# Altium schematic sheet 452006257#BDU控制板2-单片机.SchDoc
size A3; SheetNumber: 7; SheetTotal: 11
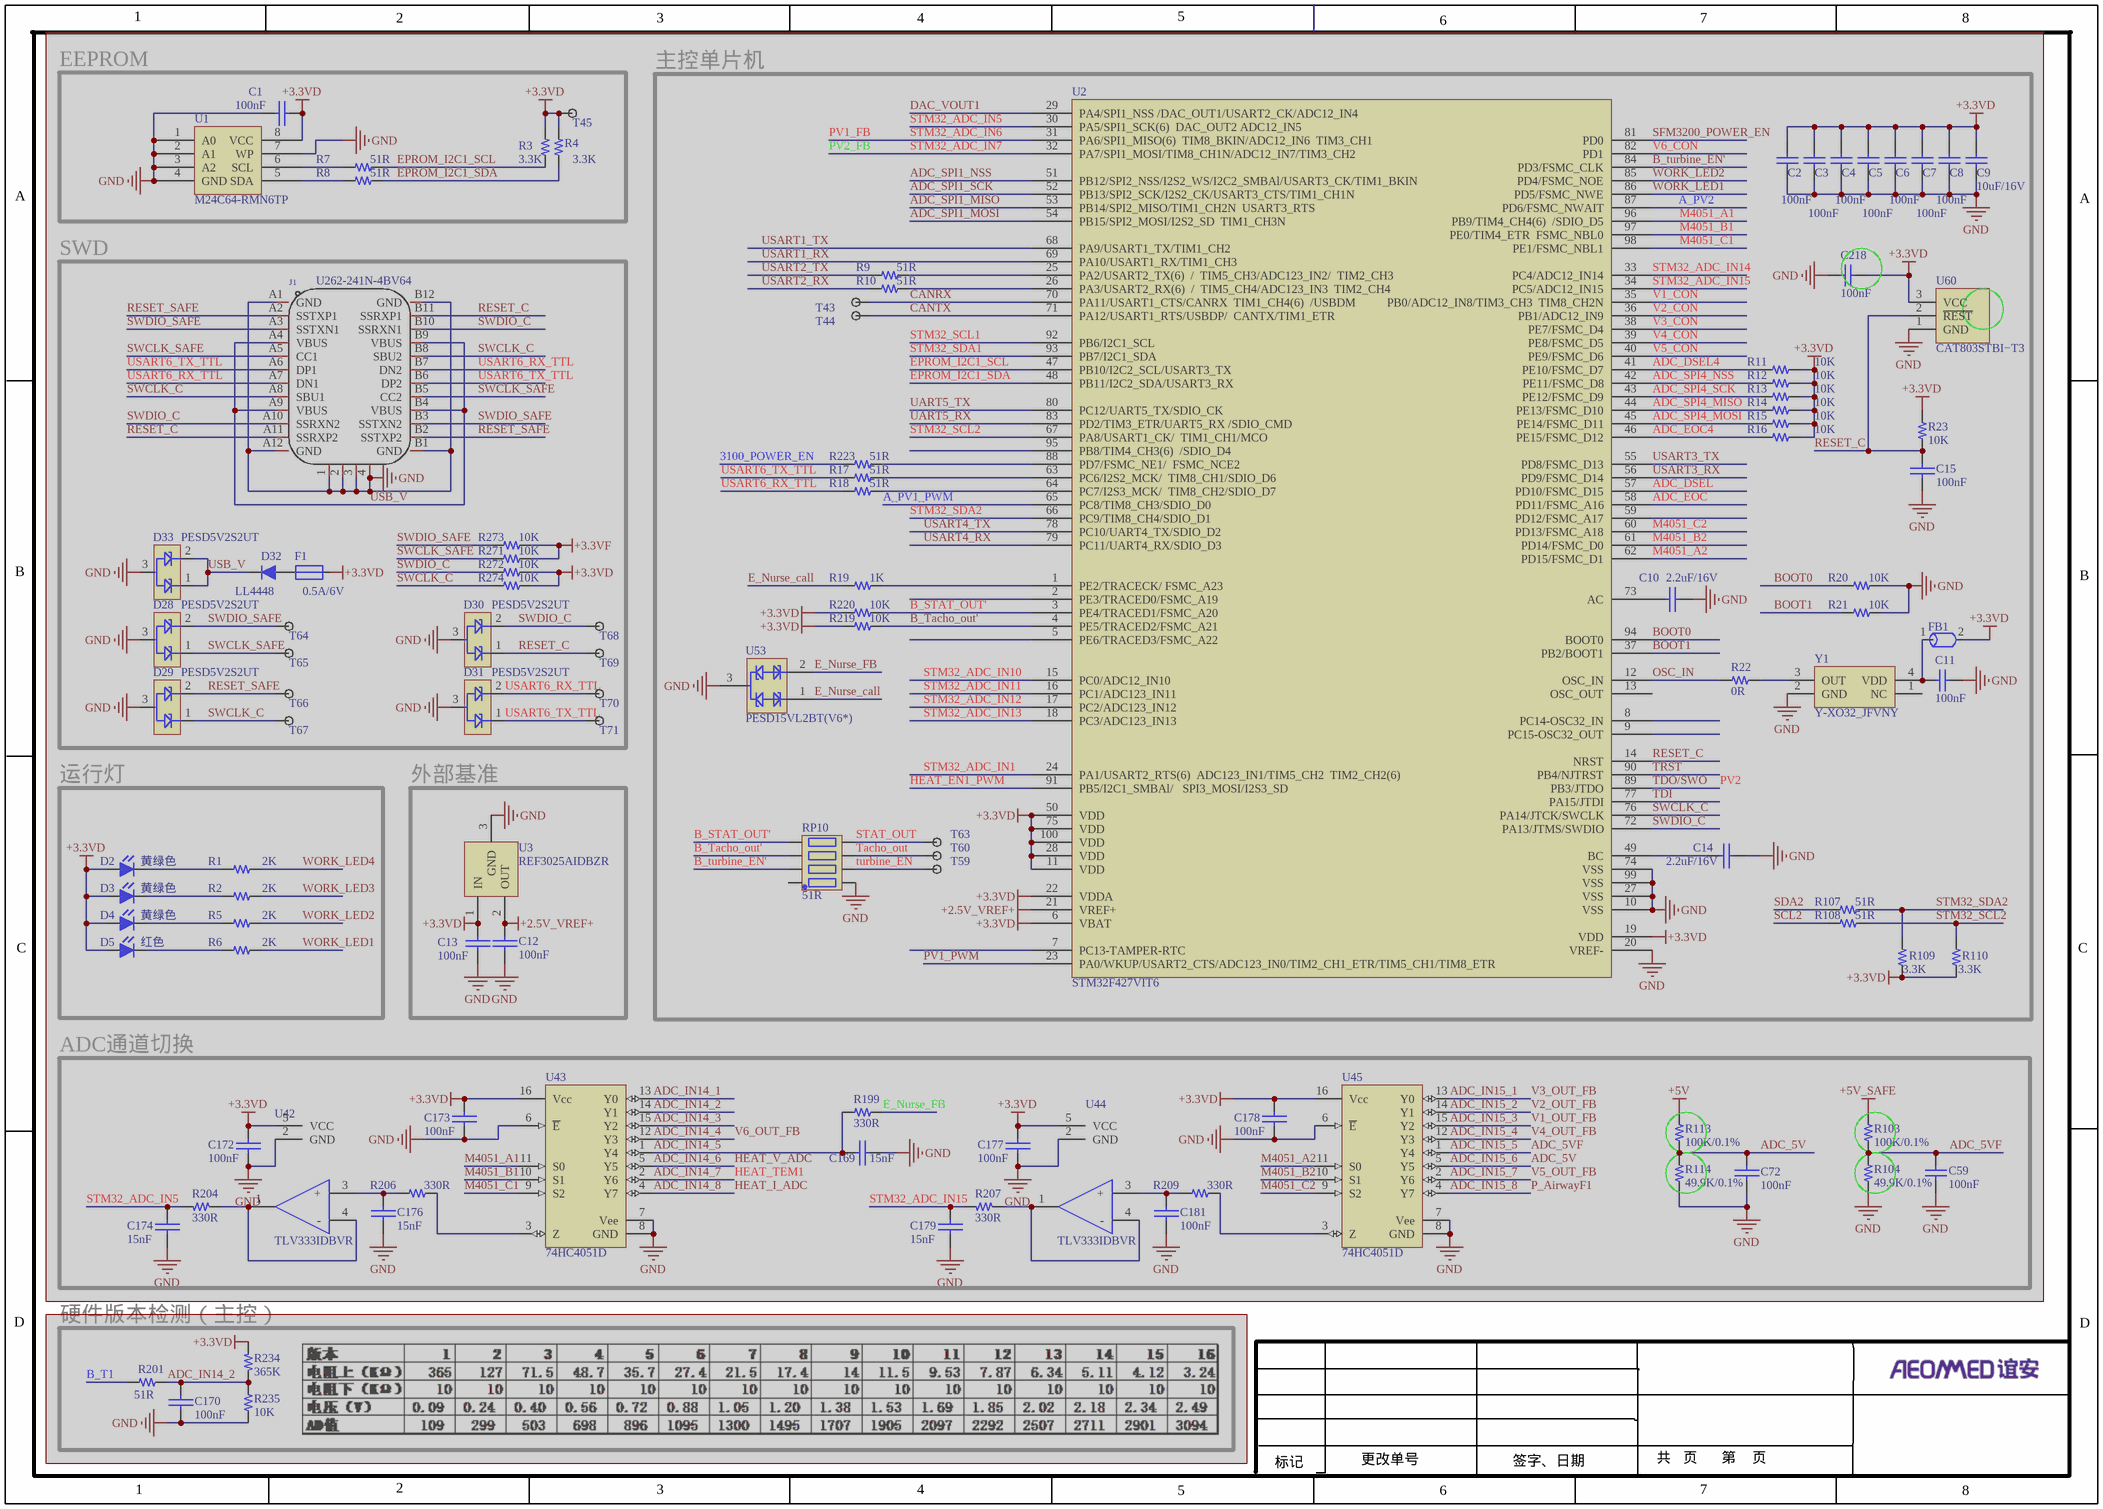
[diagram p0: 452006257#BDU控制板2-单片机.SchDoc]

## Parts
C1  100nF  [C-0603]  (masked out: inside a compile mask, not in the netlist)
C2  100nF  [C-0603]  (masked out: inside a compile mask, not in the netlist)
C3  100nF  [C-0603]  (masked out: inside a compile mask, not in the netlist)
C4  100nF  [C-0603]  (masked out: inside a compile mask, not in the netlist)
C5  100nF  [C-0603]  (masked out: inside a compile mask, not in the netlist)
C6  100nF  [C-0603]  (masked out: inside a compile mask, not in the netlist)
C7  100nF  [C-0603]  (masked out: inside a compile mask, not in the netlist)
C8  100nF  [C-0603]  (masked out: inside a compile mask, not in the netlist)
C9  10uF/16V  [C-0805]  (masked out: inside a compile mask, not in the netlist)
C10  2.2uF/16V  [C-0805]  (masked out: inside a compile mask, not in the netlist)
C11  100nF  [C-0603]  (masked out: inside a compile mask, not in the netlist)
C12  100nF  [C-0603]  (masked out: inside a compile mask, not in the netlist)
C13  100nF  [C-0603]  (masked out: inside a compile mask, not in the netlist)
C14  2.2uF/16V  [C-0805]  (masked out: inside a compile mask, not in the netlist)
C15  100nF  [C-0603]  (masked out: inside a compile mask, not in the netlist)
C59  100nF  [C-0603]  (masked out: inside a compile mask, not in the netlist)
C72  100nF  [C-0603]  (masked out: inside a compile mask, not in the netlist)
C169  15nF  [C-0603]  (masked out: inside a compile mask, not in the netlist)
C170  100nF  [C-0603]  (masked out: inside a compile mask, not in the netlist)
C172  100nF  [C-0603]  (masked out: inside a compile mask, not in the netlist)
C173  100nF  [C-0603]  (masked out: inside a compile mask, not in the netlist)
C174  15nF  [C-0603]  (masked out: inside a compile mask, not in the netlist)
C176  15nF  [C-0603]  (masked out: inside a compile mask, not in the netlist)
C177  100nF  [C-0603]  (masked out: inside a compile mask, not in the netlist)
C178  100nF  [C-0603]  (masked out: inside a compile mask, not in the netlist)
C179  15nF  [C-0603]  (masked out: inside a compile mask, not in the netlist)
C181  100nF  [C-0603]  (masked out: inside a compile mask, not in the netlist)
C218  100nF  [C-0603]  (masked out: inside a compile mask, not in the netlist)
D2  黄绿色  [LED-0805]  (masked out: inside a compile mask, not in the netlist)
D3  黄绿色  [LED-0805]  (masked out: inside a compile mask, not in the netlist)
D4  黄绿色  [LED-0805]  (masked out: inside a compile mask, not in the netlist)
D5  红色  [LED-0805]  (masked out: inside a compile mask, not in the netlist)
D28  PESD5V2S2UT  [sot23-3]  (masked out: inside a compile mask, not in the netlist)
D29  PESD5V2S2UT  [sot23-3]  (masked out: inside a compile mask, not in the netlist)
D30  PESD5V2S2UT  [sot23-3]  (masked out: inside a compile mask, not in the netlist)
D31  PESD5V2S2UT  [sot23-3]  (masked out: inside a compile mask, not in the netlist)
D32  LL4448  [DO-SOD-123]  (masked out: inside a compile mask, not in the netlist)
D33  PESD5V2S2UT  [sot23-3]  (masked out: inside a compile mask, not in the netlist)
F1  0.5A/6V  [R-1206]  (masked out: inside a compile mask, not in the netlist)
FB1  400R100MHz,0.3A,0805  [R-0805]  (value not drawn)  (masked out: inside a compile mask, not in the netlist)
J1  U262-241N-4BV64  [USB-C-SMD_TYC-324G]  (masked out: inside a compile mask, not in the netlist)
R1  2K  [R-0603]  (masked out: inside a compile mask, not in the netlist)
R2  2K  [R-0603]  (masked out: inside a compile mask, not in the netlist)
R3  3.3K  [R-0603]  (masked out: inside a compile mask, not in the netlist)
R4  3.3K  [R-0603]  (masked out: inside a compile mask, not in the netlist)
R5  2K  [R-0603]  (masked out: inside a compile mask, not in the netlist)
R6  2K  [R-0603]  (masked out: inside a compile mask, not in the netlist)
R7  51R  [R-0603]  (masked out: inside a compile mask, not in the netlist)
R8  51R  [R-0603]  (masked out: inside a compile mask, not in the netlist)
R9  51R  [R-0603]  (masked out: inside a compile mask, not in the netlist)
R10  51R  [R-0603]  (masked out: inside a compile mask, not in the netlist)
R11  10K  [R-0603]  (masked out: inside a compile mask, not in the netlist)
R12  10K  [R-0603]  (masked out: inside a compile mask, not in the netlist)
R13  10K  [R-0603]  (masked out: inside a compile mask, not in the netlist)
R14  10K  [R-0603]  (masked out: inside a compile mask, not in the netlist)
R15  10K  [R-0603]  (masked out: inside a compile mask, not in the netlist)
R16  10K  [R-0603]  (masked out: inside a compile mask, not in the netlist)
R17  51R  [R-0603]  (masked out: inside a compile mask, not in the netlist)
R18  51R  [R-0603]  (masked out: inside a compile mask, not in the netlist)
R19  1K  [R-0603]  (masked out: inside a compile mask, not in the netlist)
R20  10K  [R-0603]  (masked out: inside a compile mask, not in the netlist)
R21  10K  [R-0603]  (masked out: inside a compile mask, not in the netlist)
R22  0R  [R-0603]  (masked out: inside a compile mask, not in the netlist)
R23  10K  [R-0603]  (masked out: inside a compile mask, not in the netlist)
R103  100K/0.1%  [R-0603]  (masked out: inside a compile mask, not in the netlist)
R104  49.9K/0.1%  [R-0603]  (masked out: inside a compile mask, not in the netlist)
R107  51R  [R-0603]  (masked out: inside a compile mask, not in the netlist)
R108  51R  [R-0603]  (masked out: inside a compile mask, not in the netlist)
R109  3.3K  [R-0603]  (masked out: inside a compile mask, not in the netlist)
R110  3.3K  [R-0603]  (masked out: inside a compile mask, not in the netlist)
R113  100K/0.1%  [R-0603]  (masked out: inside a compile mask, not in the netlist)
R114  49.9K/0.1%  [R-0603]  (masked out: inside a compile mask, not in the netlist)
R199  330R  [R-0603]  (masked out: inside a compile mask, not in the netlist)
R201  51R  [R-0603]  (masked out: inside a compile mask, not in the netlist)
R204  330R  [R-0603]  (masked out: inside a compile mask, not in the netlist)
R206  330R  [R-0603]  (masked out: inside a compile mask, not in the netlist)
R207  330R  [R-0603]  (masked out: inside a compile mask, not in the netlist)
R209  330R  [R-0603]  (masked out: inside a compile mask, not in the netlist)
R219  10K  [R-0603]  (masked out: inside a compile mask, not in the netlist)
R220  10K  [R-0603]  (masked out: inside a compile mask, not in the netlist)
R223  51R  [R-0603]  (masked out: inside a compile mask, not in the netlist)
R234  365K  [R-0603]  (masked out: inside a compile mask, not in the netlist)
R235  10K  [R-0603]  (masked out: inside a compile mask, not in the netlist)
R271  10K  [R-0603]  (masked out: inside a compile mask, not in the netlist)
R272  10K  [R-0603]  (masked out: inside a compile mask, not in the netlist)
R273  10K  [R-0603]  (masked out: inside a compile mask, not in the netlist)
R274  10K  [R-0603]  (masked out: inside a compile mask, not in the netlist)
RP10  51R  [RP-0603]  (masked out: inside a compile mask, not in the netlist)
T43  直插测试点  [DIPTP]  (value not drawn)  (masked out: inside a compile mask, not in the netlist)
T44  直插测试点  [DIPTP]  (value not drawn)  (masked out: inside a compile mask, not in the netlist)
T45  直插测试点  [DIPTP]  (value not drawn)  (masked out: inside a compile mask, not in the netlist)
T59  直插测试点  [DIPTP]  (value not drawn)  (masked out: inside a compile mask, not in the netlist)
T60  直插测试点  [DIPTP]  (value not drawn)  (masked out: inside a compile mask, not in the netlist)
T63  直插测试点  [DIPTP]  (value not drawn)  (masked out: inside a compile mask, not in the netlist)
T64  直插测试点  [DIPTP]  (value not drawn)  (masked out: inside a compile mask, not in the netlist)
T65  直插测试点  [DIPTP]  (value not drawn)  (masked out: inside a compile mask, not in the netlist)
T66  直插测试点  [DIPTP]  (value not drawn)  (masked out: inside a compile mask, not in the netlist)
T67  直插测试点  [DIPTP]  (value not drawn)  (masked out: inside a compile mask, not in the netlist)
T68  直插测试点  [DIPTP]  (value not drawn)  (masked out: inside a compile mask, not in the netlist)
T69  直插测试点  [DIPTP]  (value not drawn)  (masked out: inside a compile mask, not in the netlist)
T70  直插测试点  [DIPTP]  (value not drawn)  (masked out: inside a compile mask, not in the netlist)
T71  直插测试点  [DIPTP]  (value not drawn)  (masked out: inside a compile mask, not in the netlist)
U1  M24C64-RMN6TP  [SOIC8]  (masked out: inside a compile mask, not in the netlist)
U2  STM32F427VIT6  [LQFP-100]  (masked out: inside a compile mask, not in the netlist)
U3  REF3025AIDBZR  [SOT23-3]  (masked out: inside a compile mask, not in the netlist)
U42  TLV333IDBVR  [SOT23-5]  (masked out: inside a compile mask, not in the netlist)
U43  74HC4051D  [SOIC-16(9.95*3.90)]  (masked out: inside a compile mask, not in the netlist)
U44  TLV333IDBVR  [SOT23-5]  (masked out: inside a compile mask, not in the netlist)
U45  74HC4051D  [SOIC-16(9.95*3.90)]  (masked out: inside a compile mask, not in the netlist)
U53  PESD15VL2BT(V6*)  [SOT23-3]  (masked out: inside a compile mask, not in the netlist)
U60  CAT803STBI−T3  [SOT23-3]  (masked out: inside a compile mask, not in the netlist)
Y1  Y-XO32_JFVNY  [Y-XO32_JFVNY]  (masked out: inside a compile mask, not in the netlist)

## Blocks framed on the sheet
EEPROM: C1 R3 R4 R7 R8 T45 U1
主控单片机: C2-C11 C14 C15 C218 FB1 R9-R23 R107-R110 R219 R220 R223 RP10 T43 T44 T59 T60 T63 U2 U53 U60 Y1
SWD: D28-D33 F1 J1 R271-R274 T64-T71
运行灯: D2-D5 R1 R2 R5 R6
外部基准: C12 C13 U3
ADC通道切换: C59 C72 C169 C172-C174 C176-C179 C181 R103 R104 R113 R114 R199 R204 R206 R207 R209 U42-U45
硬件版本检测（主控）: C170 R201 R234 R235

## Notes on the sheet
- 1
- 2
- 3
- 4
- 5
- 6
- 7
- 8
- A
- B
- C
- D
- 更改单号
- 共   页      第    页
- 标记
- 签字、日期

## Library data of the parts
C1 C10 C12-C15 C72 C169 C170 C172-C174 C176-C179 C181 = CAP: Capacitor
C2-C9 = CAP: Capacitor; Fitted: True
C11 C59 = C-0603: 物料编号: *; 物料名称: *; 厂家: *; 详细描述: *
C218 = C-0402: 物料编号: *; 物料名称: *; 厂家: *; 详细描述: *
D2-D5 = LED-0805
D28-D31 D33 = PESDxS2UT
D32 = Diode-SOD-123: 厂家: *; 物料名称: *; 物料编号: *; 详细描述: *
F1 = FSMD-1206: 品牌：Littelfuse，型号：1206L050YR，0.5A/6V，-40℃~85℃
FB1 = FB_1K/500mA_0805: Rdc0.3Ω,伍尔特,742792032; 名称: 贴片磁珠1K/500mA，0805; 版本: V1.00; 物料编号: 210001925; 详细描述: Rdc0.3,R材料,TDK MMZ2012R102A; 制造商: TDK
J1 = U262-241N-4BV64: 连接器类型:Type-C;标准:USB 3.1;公母:母座;触点数量:24;端口数量:1;安装方式:卧贴;额定电流 - 电源:5A;触头材质:铜合金;触头镀层:金;工作温度范围:-40℃~+85℃;焊接温度(最大值):260℃;; Manufacturer: XKB Connectivity(中国星坤); Add into BOM: yes; Connector Type: Type-C; Gender: 母座; Number of Contacts: 24; Number of Ports: 1; Current Rating - Power (Max): 5A; Welding Temperature (Max): 260℃; Name: U262-241N-4BV64; Symbol: U262-241N-4BV64; Device: U262-241N-4BV64; LCSC Part Name: Type-C 母座 卧贴; Supplier Part: C388660; Manufacturer Part: U262-241N-4BV64; Supplier Footprint: SMD; JLCPCB Part Class: Extended Part; Supplier: LCSC; Convert to PCB: yes; Standard: USB 3.1; Mounting Style: 卧贴; Contact Material: 铜合金; Contact Plating: 金; Operating Temperature Range: -40℃~+85℃
R1-R6 R11-R16 R22 R23 R103 R104 R113 R114 R199 R201 R204 R206 R207 R209 = R-0603
R7 R8 = 51Ω_1: 国巨RC0805FR-0751R; 物料编号: 210002130; 详细描述: 0805,1/8W,国巨RC0805FR-0751R; 制造商: 国巨; 版本: V1.00; 名称: 贴片电阻51±1%
R9 R10 R17-R21 R107-R110 R219 R220 R223 R271-R274 = 10K_1: 国巨RC0805FR-0710K; 版本: V1.00; 名称: 贴片电阻10K±1%; 物料编号: 210001830; 详细描述: 0805,1/8W,国巨RC0805FR-0710K; 制造商: 国巨
R234 = 100Ω_1: 国巨RC0805FR-07100R; 物料编号: 210000765; 详细描述: 0805,1/8W,国巨RC0805FR-07100R; 制造商: 国巨; 版本: V1.00; 名称: 贴片电阻100±1%
R235 = 3.3K_1: 国巨RC0805FR-073K3; 物料编号: 210001835; 详细描述: 0805,1/8W,国巨RC0805FR-073K3; 制造商: 国巨; 版本: V1.00; 名称: 贴片电阻3.3K±1%
RP10 = RP-0603
T43-T45 T59 T60 T63-T71 = Testpiont: 版本: V1.00; 名称: 直插测试点
U1 = Component_1
U2 = STM32F107
U3 = REF3140: BB,REF3140,SOT23-3,–55~+135°C,; 名称: 4.096V基准电压源REF3140; 制造商: BB; 详细描述: BB,REF3140,SOT23-3,–55~+135°C,
U42 U44 = TLV333IDBVR: 品牌：TI，型号：TLV333IDBVR,SOIC-8,–25°~+85°C,单运放，ROHS
U43 U45 = 74HC4051D: NXP,74HC4051D,SOIC-16,-40~+125°C ,; 版本: V1.00; 名称: 8路模拟开关74HC4051D; 物料编号: 210001936; 详细描述: NXP,74HC4051D,SOIC-16,-40~+125°C ,; 制造商: NXP
U53 = PESD15VL2BT: 品牌：NXP，型号：PESD15VL2BT，SOT23-3，ROHS; 制造商: NXP; 名称: ESD保护PESD15VL2BT; 详细描述: NXP,PESD15VL2BT,SOT23-3,
U60 = CAT803TTBI-GT3: ON,CAT803TTBI-GT3,SOT23-3,-40o~+85oC,ROHS; 名称: 电源监视器CAT803TTBI-GT3; 制造商: ON; 详细描述: ON,CAT803TTBI-GT3,SOT23-3,-40o~+85oC,ROHS
Y1 = Y-XO32_JFVNY: 制造商: 晶宇兴